# EAGLE design ManualBoardV1 (EAGLE 9.6.2)
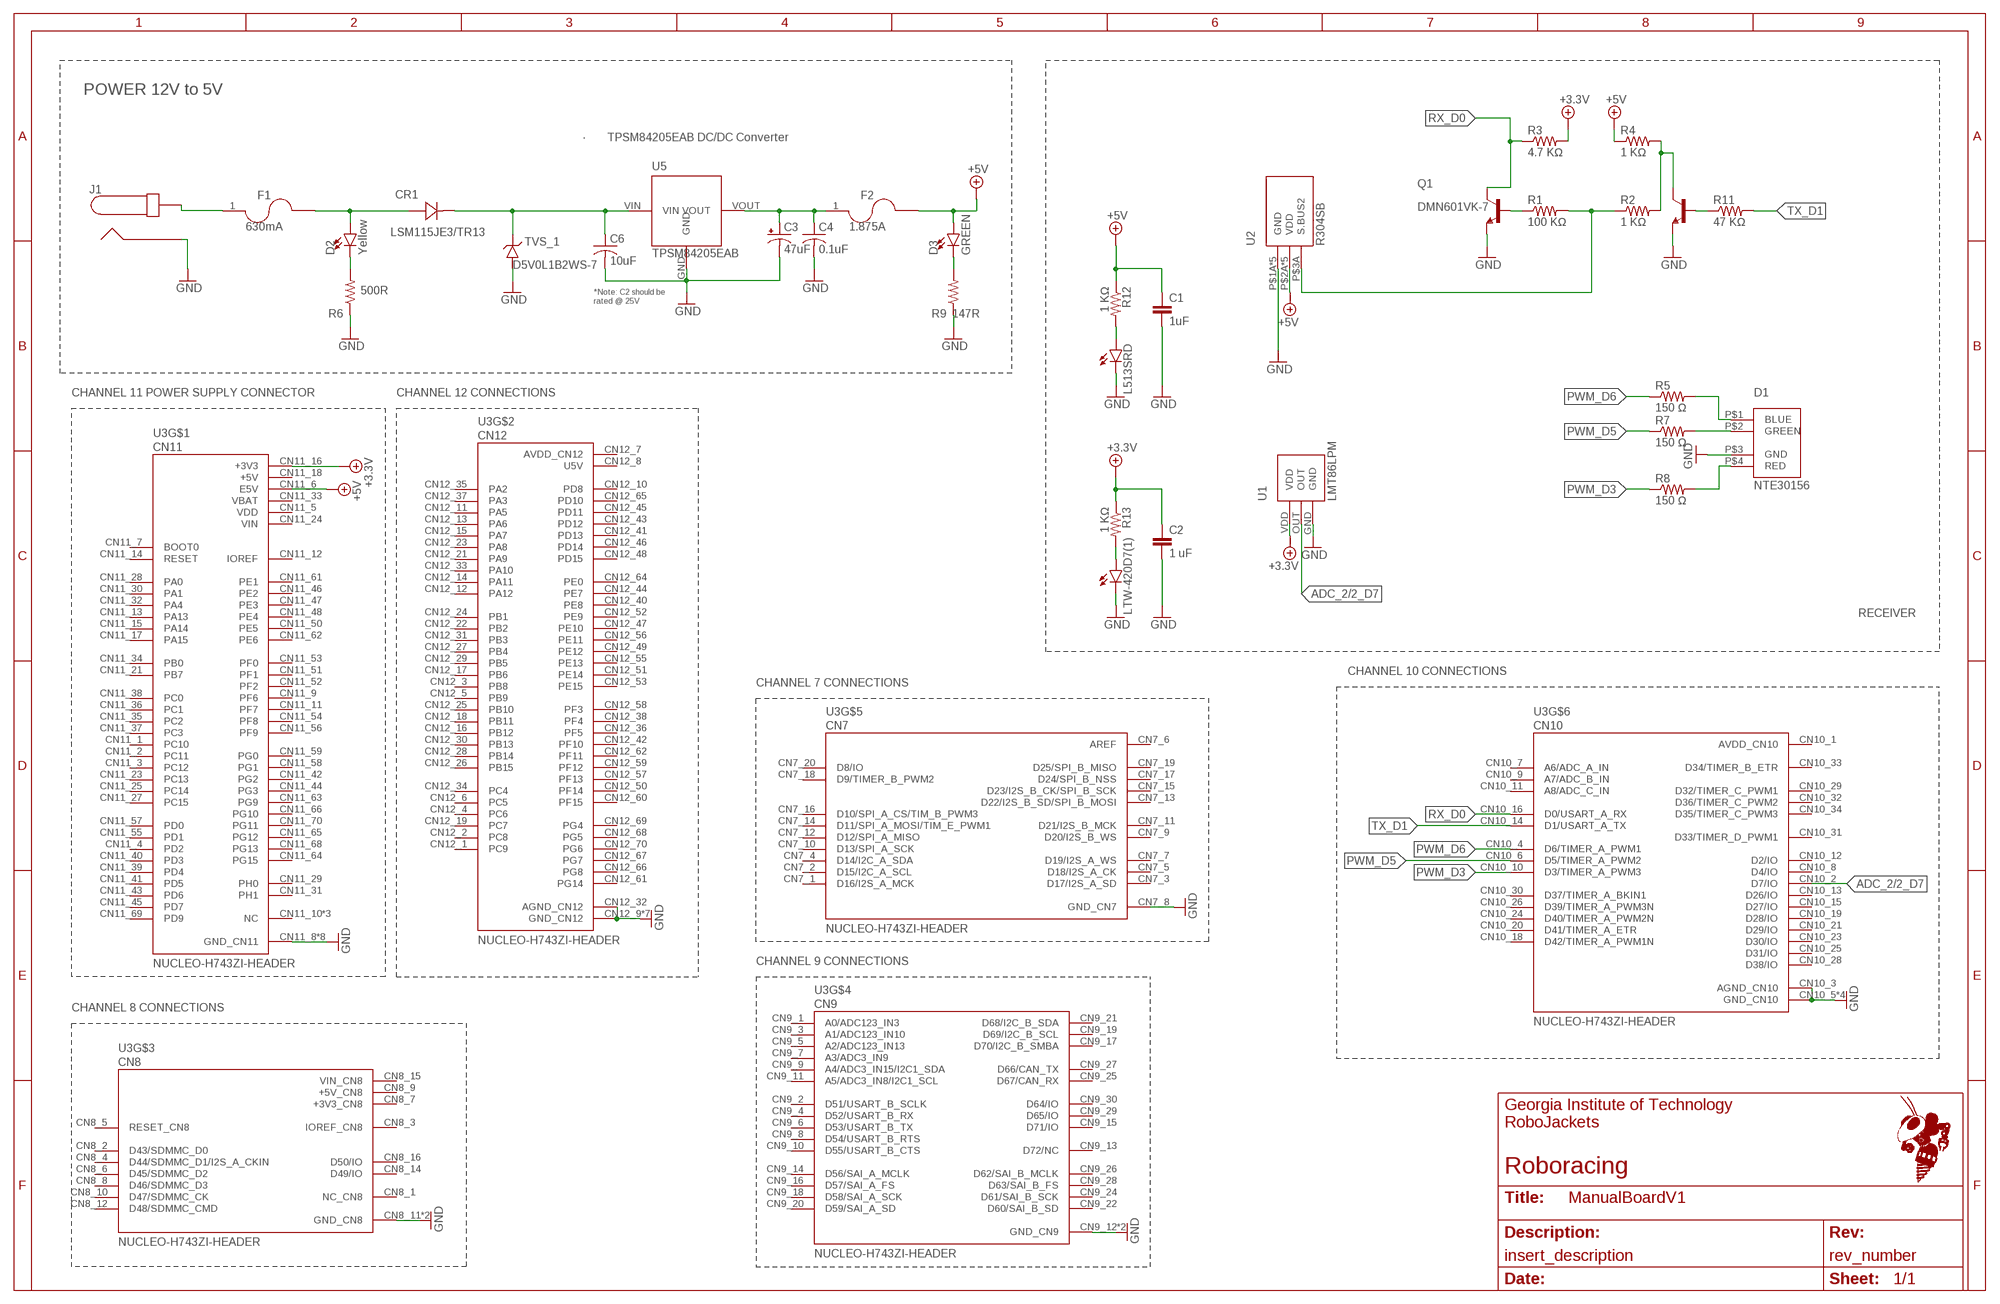
[diagram p0: schematic, sheet 1]
FRAME1 (FRAME_11_17): REVISION: rev_number; SCH_DESC: insert_description; TEAM: Roboracing

## Parts
C1  1uF  C2,5-3  [C2.5-3]
C2  1 uF  C2,5-3  [C2.5-3]
C3  47uF  47UF-POLAR-EIA3528-10V-10%  [EIA3528]
C4  0.1uF  C-USC0805  [C0805]
C6  10uF  C-USC0805  [C0805]
CR1  LSM115JE3/TR13  [DO-214BA_MCH]
D1  NTE30156  [4-PIN]
D2  Yellow  LED-YELLOW0603  [LED-0603]
D3  GREEN  LED-GREEN1206  [LED-1206]
F1  630mA  SMD_FUSE0603  [F0603]
F2  1.875A  SMD_FUSE0603  [F0603]
J1  PJ-037A  [PJ-037A]
L513SRD  LED5MM  [LED5MM]
LTW-420D7(1)  LED5MM  [LED5MM]
Q1  DMN601VK-7  [SOT563]
R1  100 KΩ  R-US_0204/7  [0204/7]
R2  1 KΩ  R-US_0204/7  [0204/7]
R3  4.7 KΩ  R-US_0204/7  [0204/7]
R4  1 KΩ  R-US_0204/7  [0204/7]
R5  150 Ω  R-US_0204/7  [0204/7]
R6  500R  R-US_R0603  [R0603]
R7  150 Ω  R-US_0204/7  [0204/7]
R8  150 Ω  R-US_0204/7  [0204/7]
R9  147R  R-US_R0603  [R0603]
R11  47 KΩ  R-US_0204/7  [0204/7]
R12  1 KΩ  R-US_0204/7  [0204/7]
R13  1 KΩ  R-US_0204/7  [0204/7]
TVS_1  D5V0L1B2WS-7  [SOD-323]
U1  LMT86LPM  [LP]
U2  R304SB  [R304SB]
U3  NUCLEO-H743ZI-HEADER  [MODULE_NUCLEO-HEADER]
U5  TPSM84205EAB  [TPSM84205EAB]

## Nets
5V_MAIN: C3.A(+) C4.1 F2.1 U5.VOUT
+3.3V: C2.1 R3.2 R13.1 U1.VDD U3.CN11_16(+3V3)
+5V: C1.1 D3.A F2.2 R4.1 R12.1 U2.P$2A(VDD) U2.P$2B(VDD) U2.P$2C(VDD) U2.P$2D(VDD) U2.P$2E(VDD) U3.CN11_6(E5V)
ADC_2/2_D7: U1.OUT U3.CN10_2(D7/IO)
GND: C1.2 C2.2 C3.C(-) C4.2 C6.2 D1.P$3(GND) J1.P$1 L513SRD.K(C) LTW-420D7(1).K(C) Q1.D1(E) Q1.D2(E1) R6.1 R9.1 TVS_1.A U1.GND U2.P$1A(GND) U2.P$1B(GND) U2.P$1C(GND) U2.P$1D(GND) U2.P$1E(GND) U3.CN7_8(GND_CN7) U3.CN8_11(GND_CN8) U3.CN8_13(GND_CN8) U3.CN9_12(GND_CN9) U3.CN9_23(GND_CN9) U3.CN10_5(GND_CN10) U3.CN10_17(GND_CN10) U3.CN10_22(GND_CN10) U3.CN10_27(GND_CN10) U3.CN11_8(GND_CN11) U3.CN11_19(GND_CN11) U3.CN11_20(GND_CN11) U3.CN11_22(GND_CN11) U3.CN11_49(GND_CN11) U3.CN11_60(GND_CN11) U3.CN11_71(GND_CN11) U3.CN11_72(GND_CN11) U3.CN12_9(GND_CN12) U3.CN12_20(GND_CN12) U3.CN12_32(AGND_CN12) U3.CN12_39(GND_CN12) U3.CN12_54(GND_CN12) U3.CN12_63(GND_CN12) U3.CN12_71(GND_CN12) U3.CN12_72(GND_CN12) U5.GND
N$1: Q1.G1(B) R1.1
N$2: Q1.S2(C1) R2.2 R4.2
N$3: C6.1 CR1.1 TVS_1.C U5.VIN
N$4: F1.1 J1.P$2
N$5: D1.P$1(BLUE) R5.2
N$6: R1.2 R2.1 U2.P$3A(S.BUS2)
N$7: D1.P$2(GREEN) R7.2
N$8: CR1.2 D2.A F1.2
N$9: D1.P$4(RED) R8.2
N$10: D2.C R6.2
N$11: D3.C R9.2
N$12: U3.CN10_3(AGND_CN10)
N$13: Q1.G2(B1) R11.1
N$16: L513SRD.A R12.2
N$17: LTW-420D7(1).A R13.2
PWM_D3: R8.1 U3.CN10_10(D3/TIMER_A_PWM3)
PWM_D5: R7.1 U3.CN10_6(D5/TIMER_A_PWM2)
PWM_D6: R5.1 U3.CN10_4(D6/TIMER_A_PWM1)
RX_D0: Q1.S1(C) R3.1 U3.CN10_16(D0/USART_A_RX)
TX_D1: R11.2 U3.CN10_14(D1/USART_A_TX)
Unconnected: U3.CN7_1(D16/I2S_A_MCK) U3.CN7_2(D15/I2C_A_SCL) U3.CN7_3(D17/I2S_A_SD) U3.CN7_4(D14/I2C_A_SDA) U3.CN7_5(D18/I2S_A_CK) U3.CN7_7(D19/I2S_A_WS) U3.CN7_9(D20/I2S_B_WS) U3.CN7_10(D13/SPI_A_SCK) U3.CN7_11(D21/I2S_B_MCK) U3.CN7_12(D12/SPI_A_MISO) U3.CN7_13(D22/I2S_B_SD/SPI_B_MOSI) U3.CN7_14(D11/SPI_A_MOSI/TIM_E_PWM1) U3.CN7_15(D23/I2S_B_CK/SPI_B_SCK) U3.CN7_16(D10/SPI_A_CS/TIM_B_PWM3) U3.CN7_17(D24/SPI_B_NSS) U3.CN7_18(D9/TIMER_B_PWM2) U3.CN7_19(D25/SPI_B_MISO) U3.CN7_20(D8/IO) U3.CN8_1(NC_CN8) U3.CN8_2(D43/SDMMC_D0) U3.CN8_3(IOREF_CN8) U3.CN8_4(D44/SDMMC_D1/I2S_A_CKIN) U3.CN8_5(RESET_CN8) U3.CN8_6(D45/SDMMC_D2) U3.CN8_8(D46/SDMMC_D3) U3.CN8_10(D47/SDMMC_CK) U3.CN8_12(D48/SDMMC_CMD) U3.CN8_14(D49/IO) U3.CN8_16(D50/IO) U3.CN9_1(A0/ADC123_IN3) U3.CN9_2(D51/USART_B_SCLK) U3.CN9_3(A1/ADC123_IN10) U3.CN9_4(D52/USART_B_RX) U3.CN9_5(A2/ADC123_IN13) U3.CN9_6(D53/USART_B_TX) U3.CN9_7(A3/ADC3_IN9) U3.CN9_8(D54/USART_B_RTS) U3.CN9_9(A4/ADC3_IN15/I2C1_SDA) U3.CN9_10(D55/USART_B_CTS) U3.CN9_11(A5/ADC3_IN8/I2C1_SCL) U3.CN9_13(D72/NC) U3.CN9_14(D56/SAI_A_MCLK) U3.CN9_15(D71/IO) U3.CN9_16(D57/SAI_A_FS) U3.CN9_17(D70/I2C_B_SMBA) U3.CN9_18(D58/SAI_A_SCK) U3.CN9_19(D69/I2C_B_SCL) U3.CN9_20(D59/SAI_A_SD) U3.CN9_21(D68/I2C_B_SDA) U3.CN9_22(D60/SAI_B_SD) U3.CN9_24(D61/SAI_B_SCK) U3.CN9_25(D67/CAN_RX) U3.CN9_26(D62/SAI_B_MCLK) U3.CN9_27(D66/CAN_TX) U3.CN9_28(D63/SAI_B_FS) U3.CN9_29(D65/IO) U3.CN9_30(D64/IO) U3.CN10_7(A6/ADC_A_IN) U3.CN10_8(D4/IO) U3.CN10_9(A7/ADC_B_IN) U3.CN10_11(A8/ADC_C_IN) U3.CN10_12(D2/IO) U3.CN10_13(D26/IO) U3.CN10_15(D27/IO) U3.CN10_18(D42/TIMER_A_PWM1N) U3.CN10_19(D28/IO) U3.CN10_20(D41/TIMER_A_ETR) U3.CN10_21(D29/IO) U3.CN10_23(D30/IO) U3.CN10_24(D40/TIMER_A_PWM2N) U3.CN10_25(D31/IO) U3.CN10_26(D39/TIMER_A_PWM3N) U3.CN10_28(D38/IO) U3.CN10_29(D32/TIMER_C_PWM1) U3.CN10_30(D37/TIMER_A_BKIN1) U3.CN10_31(D33/TIMER_D_PWM1) U3.CN10_32(D36/TIMER_C_PWM2) U3.CN10_33(D34/TIMER_B_ETR) U3.CN10_34(D35/TIMER_C_PWM3) U3.CN11_1(PC10) U3.CN11_2(PC11) U3.CN11_3(PC12) U3.CN11_4(PD2) U3.CN11_7(BOOT0) U3.CN11_9(PF6) U3.CN11_10(NC) U3.CN11_11(PF7) U3.CN11_12(IOREF) U3.CN11_13(PA13) U3.CN11_14(RESET) U3.CN11_15(PA14) U3.CN11_17(PA15) U3.CN11_21(PB7) U3.CN11_23(PC13) U3.CN11_25(PC14) U3.CN11_26(NC) U3.CN11_27(PC15) U3.CN11_28(PA0) U3.CN11_29(PH0) U3.CN11_30(PA1) U3.CN11_31(PH1) U3.CN11_32(PA4) U3.CN11_34(PB0) U3.CN11_35(PC2) U3.CN11_36(PC1) U3.CN11_37(PC3) U3.CN11_38(PC0) U3.CN11_39(PD4) U3.CN11_40(PD3) U3.CN11_41(PD5) U3.CN11_42(PG2) U3.CN11_43(PD6) U3.CN11_44(PG3) U3.CN11_45(PD7) U3.CN11_46(PE2) U3.CN11_47(PE3) U3.CN11_48(PE4) U3.CN11_50(PE5) U3.CN11_51(PF1) U3.CN11_52(PF2) U3.CN11_53(PF0) U3.CN11_54(PF8) U3.CN11_55(PD1) U3.CN11_56(PF9) U3.CN11_57(PD0) U3.CN11_58(PG1) U3.CN11_59(PG0) U3.CN11_61(PE1) U3.CN11_62(PE6) U3.CN11_63(PG9) U3.CN11_64(PG15) U3.CN11_65(PG12) U3.CN11_66(PG10) U3.CN11_67(NC) U3.CN11_68(PG13) U3.CN11_69(PD9) U3.CN11_70(PG11) U3.CN12_1(PC9) U3.CN12_2(PC8) U3.CN12_3(PB8) U3.CN12_4(PC6) U3.CN12_5(PB9) U3.CN12_6(PC5) U3.CN12_10(PD8) U3.CN12_11(PA5) U3.CN12_12(PA12) U3.CN12_13(PA6) U3.CN12_14(PA11) U3.CN12_15(PA7) U3.CN12_16(PB12) U3.CN12_17(PB6) U3.CN12_18(PB11) U3.CN12_19(PC7) U3.CN12_21(PA9) U3.CN12_22(PB2) U3.CN12_23(PA8) U3.CN12_24(PB1) U3.CN12_25(PB10) U3.CN12_26(PB15) U3.CN12_27(PB4) U3.CN12_28(PB14) U3.CN12_29(PB5) U3.CN12_30(PB13) U3.CN12_31(PB3) U3.CN12_33(PA10) U3.CN12_34(PC4) U3.CN12_35(PA2) U3.CN12_36(PF5) U3.CN12_37(PA3) U3.CN12_38(PF4) U3.CN12_40(PE8) U3.CN12_41(PD13) U3.CN12_42(PF10) U3.CN12_43(PD12) U3.CN12_44(PE7) U3.CN12_45(PD11) U3.CN12_46(PD14) U3.CN12_47(PE10) U3.CN12_48(PD15) U3.CN12_49(PE12) U3.CN12_50(PF14) U3.CN12_51(PE14) U3.CN12_52(PE9) U3.CN12_53(PE15) U3.CN12_55(PE13) U3.CN12_56(PE11) U3.CN12_57(PF13) U3.CN12_58(PF3) U3.CN12_59(PF12) U3.CN12_60(PF15) U3.CN12_61(PG14) U3.CN12_62(PF11) U3.CN12_64(PE0) U3.CN12_65(PD10) U3.CN12_66(PG8) U3.CN12_67(PG7) U3.CN12_68(PG5) U3.CN12_69(PG4) U3.CN12_70(PG6)

## Notes on the sheet
- POWER 12V to 5V
- ·       TPSM84205EAB DC/DC Converter
- *Note: C2 should be
  rated @ 25V
- CHANNEL 11 POWER SUPPLY CONNECTOR | CHANNEL 12 CONNECTIONS
- RECEIVER
- CHANNEL 10 CONNECTIONS
- CHANNEL 7 CONNECTIONS
- CHANNEL 9 CONNECTIONS
- CHANNEL 8 CONNECTIONS

## Power pins joined to a net without a drawn wire
+3V3_CN8: U3.CN8_7(+3V3_CN8)
+5V: U3.CN11_18(+5V)
+5V_CN8: U3.CN8_9(+5V_CN8)
AREF: U3.CN7_6(AREF)
AVDD_CN10: U3.CN10_1(AVDD_CN10)
AVDD_CN12: U3.CN12_7(AVDD_CN12)
U5V: U3.CN12_8(U5V)
VBAT: U3.CN11_33(VBAT)
VDD: U3.CN11_5(VDD)
VIN: U3.CN11_24(VIN)
VIN_CN8: U3.CN8_15(VIN_CN8)

## Library data of the parts
C1 C2 = capacitor-wima:C: CAPACITOR naming: grid - package width
C3 = SparkFun-Capacitors:47UF-POLAR: 47µF polarized capacitors A capacitor is a passive two-terminal electrical component used to store electrical energy temporarily in an electric field.; PROD_ID: CAP-08310
C4 C6 = rcl:C-US: CAPACITOR, American symbol; SPICEPREFIX: C
CR1 = RoboRacing_STM:LSM115JE3/TR13; COPYRIGHT: Copyright (C) 2022 Ultra Librarian. All rights reserved.; MANUFACTURER_PART_NUMBER: LSM115JE3/TR13; MFR_NAME: Microchip
D1 = RoboRacing Manual Board:NTE30156: Red, Green, Blue (RGB) - LED Indication - Discrete 2V Red, 3.2V Green, 3.2V Blue Radial https://www.nteinc.com/specs/30100to30199/pdf/nte30153_56.pdf; DKPN: 2368-NTE30156-ND
D2 = RoboJackets-LEDs:LED-YELLOW: Yellow SMD LED Used in manufacturing several products at SparkFun. Packages: 0603 - SMD 0603 package[Product Link] <http://www.kingbrightusa.com/product.asp?catalog_name=LED&product_id=APT1608SYCK> 0603 -SMART - SMART SMD 0603 package (more efficient/more expensive) [Product Link] <http://www.osram-os.com/osram_os/en/products/product-catalog/led-light-emitting-diodes/smartled-0603/ly-l29k/index.jsp> LilyPad - SMD1206 package[Product Datasheet] <https://www.sparkfun.com/datasheets/DevTools/LilyPad/Q150YUS4.pdf> SparkFun Products: Blynk Board <https://www.sparkfun.com/products/13794> IOIO-OTG <https://www.sparkfun.com/products/13613> XBee Explorer Serial <https://www.sparkfun.com/products/13225>; PROD_ID: DIO-09003
D3 = RoboJackets-LEDs:LED-GREEN: Green SMD LED Used in manufacturing of various products at SparkFun Packages: 0603 - SMD 0603 package [Product Link] <http://www.futureelectronics.com/en/technologies/semiconductors/optoelectronics/leds/Pages/9894312-LTST-C190GKT.aspx?CrossPart=HSMG-C190&IM=0> LilyPad 1206 - SMD1206 LilyPad package [Product Link] <http://www.futureelectronics.com/en/Technologies/Product.aspx?ProductID=IN150NGHARVATEKCORPORATION2049943&IM=0> 1206 - SMD1206 package [Product Link] <http://www.futureelectronics.com/en/technologies/semiconductors/optoelectronics/leds/Pages/8315665-LTST-C150KGKT.aspx?IM=0> 1206 Bottom Mount -SMD 1206 Bottom Mount [Product Link] <http://www.digikey.com/product-detail/en/lite-on-inc/LTST-C230KGKT/160-1456-1-ND/386854> SparkFun Products: Pro Mini 328 -5V <https://www.sparkfun.com/products/821> RedBoard <https://www.sparkfun.com/products/12757> MP3 Trigger <https://www.sparkfun.com/products/13720> Makey Makey <https://www.sparkfun.com/products/11076>; PROD_ID: DIO-00862
F1 F2 = RoboJackets-Fuses:SMD_FUSE: Generic part for SMD fuses
J1 = RoboJackets-Connectors:PJ-037A*: Description: Power Barrel Connector Jack 2.10mm ID (0.083"), 5.50mm OD (0.217") Through Hole, Right Angle Link 2.5A: Digi-Key <https://www.digikey.com/products/en?keywords=CP-037A-ND> Link 5A: Digi-Key <https://www.digikey.com/product-detail/en/cui-devices/PJ-037AH/CP-037AH-ND/1644547>; DKPN: CP-037A-ND
L513SRD LTW-420D7(1) = led:LED: LED OSRAM: - CHIPLED LG R971, LG N971, LY N971, LG Q971, LY Q971, LO R971, LY R971 LH N974, LH R974 LS Q976, LO Q976, LY Q976 LO Q996 - Hyper CHIPLED LW Q18S LB Q993, LB Q99A, LB R99A - SideLED LS A670, LO A670, LY A670, LG A670, LP A670 LB A673, LV A673, LT A673, LW A673 LH A674 LY A675 LS A676, LA A676, LO A676, LY A676, LW A676 LS A679, LY A679, LG A679 - Hyper Micro SIDELED® LS Y876, LA Y876, LO Y876, LY Y876 LT Y87S - SmartLED LW L88C, LW L88S LB L89C, LB L89S, LG L890 LS L89K, LO L89K, LY L89K LS L896, LA L896, LO L896, LY L896 - TOPLED LS T670, LO T670, LY T670, LG T670, LP T670 LSG T670, LSP T670, LSY T670, LOP T670, LYG T670 LG T671, LOG T671, LSG T671 LB T673, LV T673, LT T673, LW T673 LH T674 LS T676, LA T676, LO T676, LY T676, LB T676, LH T676, LSB T676, LW T676 LB T67C, LV T67C, LT T67C, LS T67K, LO T67K, LY T67K, LW E67C LS E67B, LA E67B, LO E67B, LY E67B, LB E67C, LV E67C, LT E67C LW T67C LS T679, LY T679, LG T679 LS T770, LO T770, LY T770, LG T770, LP T770 LB T773, LV T773, LT T773, LW T773 LH T774 LS E675, LA E675, LY E675, LS T675 LS T776, LA T776, LO T776, LY T776, LB T776 LHGB T686 LT T68C, LB T68C - Hyper Mini TOPLED® LB M676 - Mini TOPLED Santana® LG M470 LS M47K, LO M47K, LY M47K Source: http://www.osram.convergy.de LUXEON: - LUMILED® LXK2-PW12-R00, LXK2-PW12-S00, LXK2-PW14-U00, LXK2-PW14-V00 LXK2-PM12-R00, LXK2-PM12-S00, LXK2-PM14-U00 LXK2-PE12-Q00, LXK2-PE12-R00, LXK2-PE12-S00, LXK2-PE14-T00, LXK2-PE14-U00 LXK2-PB12-K00, LXK2-PB12-L00, LXK2-PB12-M00, LXK2-PB14-N00, LXK2-PB14-P00, LXK2-PB14-Q00 LXK2-PR12-L00, LXK2-PR12-M00, LXK2-PR14-Q00, LXK2-PR14-R00 LXK2-PD12-Q00, LXK2-PD12-R00, LXK2-PD12-S00 LXK2-PH12-R00, LXK2-PH12-S00 LXK2-PL12-P00, LXK2-PL12-Q00, LXK2-PL12-R00 Source: www.luxeon.com KINGBRIGHT: KA-3528ASYC Source: www.kingbright.com
Q1 = RoboRacing Manual Board:DMN601VK-7: Mosfet Array 2 N-Channel (Dual) 60V 305mA 250mW Surface Mount SOT-563 https://www.diodes.com/assets/Datasheets/ds30655.pdf; DKPN: DMN601VKDITR-ND
R1-R9 R11-R13 = rcl:R-US_: RESISTOR, American symbol; SPICEPREFIX: R
TVS_1 = RoboJackets-Diodes:D5V0L1B2WS-7: TVS 5V Diode Datasheet <https://www.diodes.com/assets/Datasheets/D5V0L1B2WS.pdf>; DKPN: D5V0L1B2WS-7DICT-ND
U1 = RoboRacing Manual Board:LMT86LPM: https://www.ti.com/lit/ds/symlink/lmt86.pdf?HQS=dis-dk-null-digikeymode-dsf-pf-null-wwe&ts=1642975424297 Temperature Sensor Analog, Local -50°C ~ 150°C 10.9mV/°C TO-92-3; DKPN: 296-46127-1-ND
U2 = RoboRacing Manual Board:R304SB: R304SB– T-FHSS Telemetry System 4-Channel Receiver https://futabausa.com/product/r304sb/; DKPN: N/A
U3 = RoboRacing_STM:NUCLEO-H743ZI-HEADER: STM32F429ZI, mbed-Enabled Development Nucleo-144 STM32F4 ARM® Cortex®-M4 MCU 32-Bit Embedded Evaluation Board; MANUFACTURER: STMicroelectronics; MAXIMUM_PACKAGE_HEIGHT: N/A; PARTREV: 8; STANDARD: Manufacturer Recommendations
U5 = RoboRacing_STM:TPSM84205EAB: 1.5A, 28V Input, 5V Output Power Module https://www.ti.com/lit/ds/symlink/tpsm84205.pdf?ts=1642464100890&ref_url=https%253A%252F%252Fwww.ti.com%252Fstore%252Fti%252Fen%252Fp%252Fproduct%252F%253Fp%253DTPSM84205EAB; DKPN: 296-47074-ND

## Net classes
1 vcc: width 0.3 mm

## Board
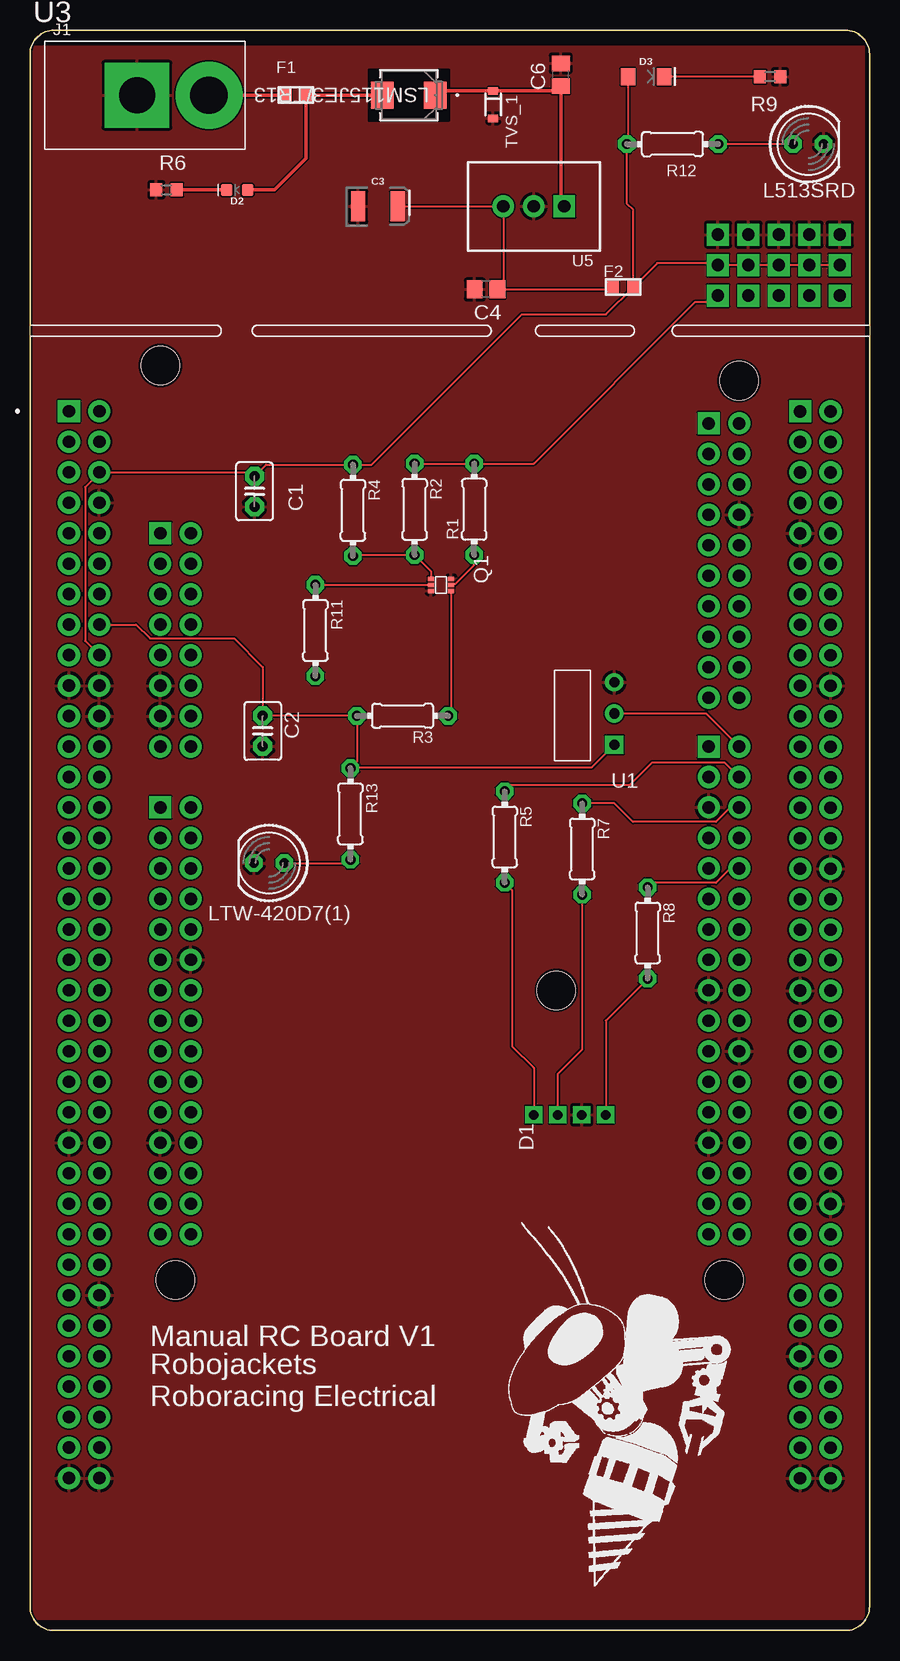
[diagram p1: board, top side]
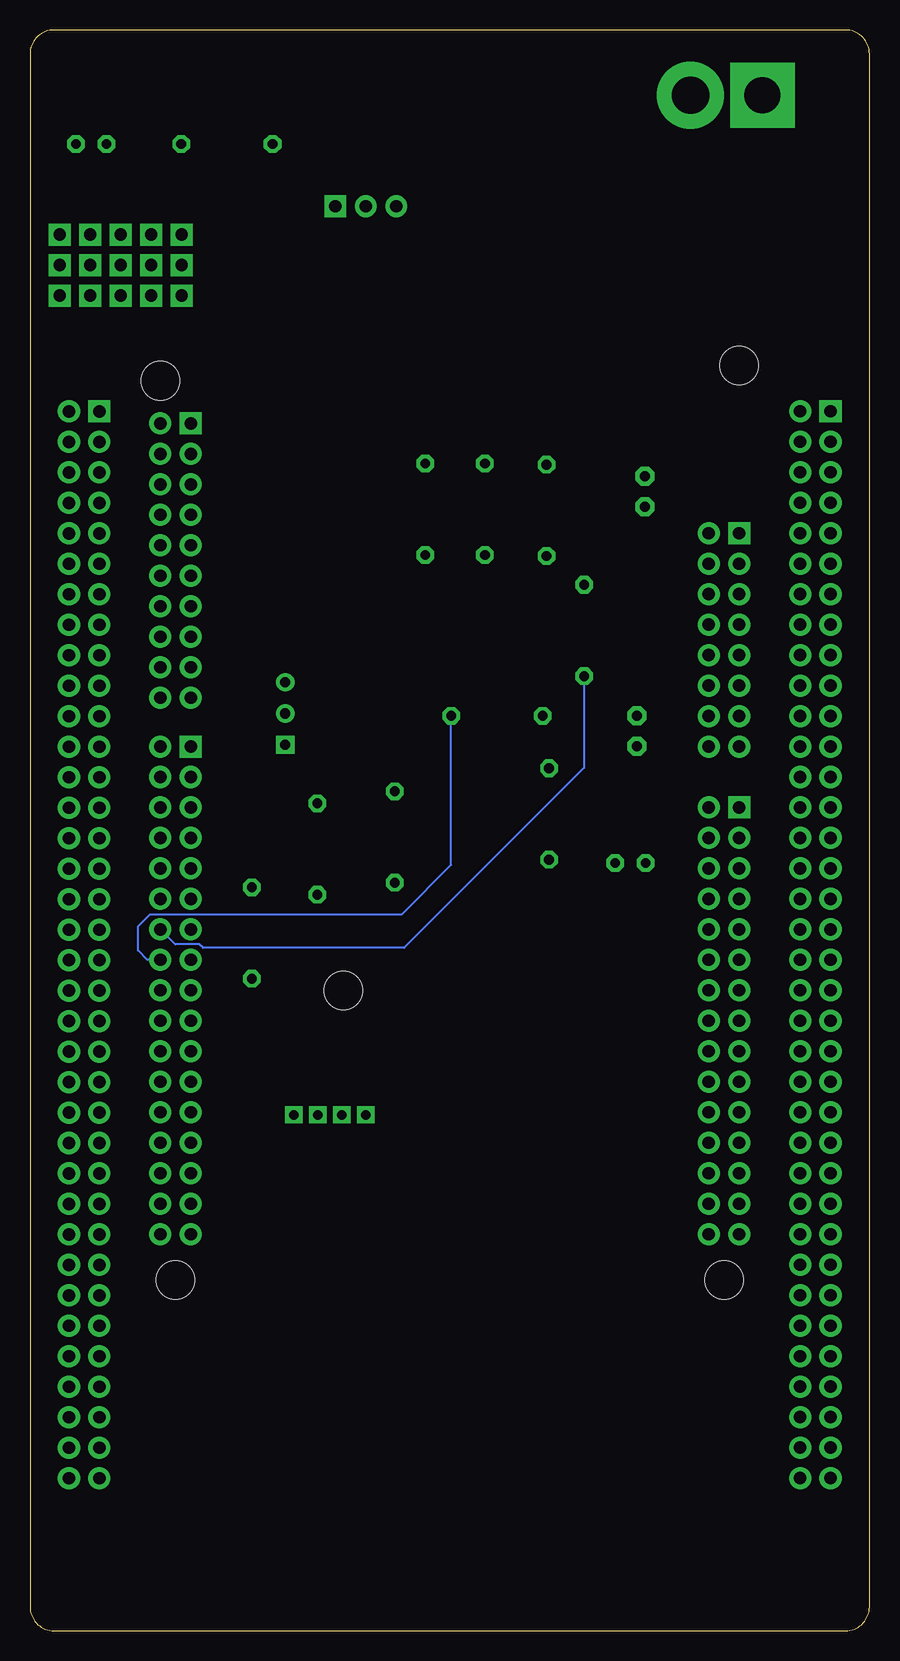
[diagram p2: board, bottom side, seen from below]

Size 70 x 133.4 mm. Coordinates in mm from the lower left corner, seen from the top.
Outline: 0,2 0,131.4 arc-90 2,133.4 68,133.4 arc-90 70,131.4 70,2 arc-90 68,0 2,0 arc-90 0,2
Copper layers (1*16): Top 0.035mm / dielectric 1.6mm / Bottom 0.035mm
Design rules "jlcpcb-2layers": minimum track width 5mil, minimum drill 0.3mm, track to track 5mil, track to pad 5mil, pad to pad 5mil, via to via 5mil, smd to smd 5mil, copper to edge 0.2mm, drill to drill 6mil, minimum pad ring 10mil, minimum via ring 3mil, stop-mask expansion 4mil, vias tented up to drill 0mil, thermal gap 10mil

### Footprints (pad centres in the part's own frame; a part is rotated, then mirrored left to right if it is on the bottom)
C2.5-3 = drill 0.813 pad 1.6 octagon: 1 -1.27,0; 2 1.27,0
EIA3528 = smd 1.2 x 2.5: A 1.65,0; C -1.65,0
C0805 = smd 1.3 x 1.5: 1 -0.95,0; 2 0.95,0
DO-214BA_MCH = smd 1.874 x 2.26: 1 -2.207,0; 2 2.207,0
4-PIN = drill 0.8 pad 1.016 square: P$1 0,6; P$2 0,4; P$3 0,2; P$4 0,0
LED-0603 = smd 1 x 1: A -0.877,0; C 0.877,0
LED-1206 = smd 1.2 x 1.4: A -1.5,0; C 1.5,0
F0603 = smd 1 x 1.1: 1 -0.85,0; 2 0.85,0
PJ-037A = drill 3 square: P$1 0,0 | drill 3.1: P$2 6,0
LED5MM = drill 0.813 octagon: A -1.27,0; K 1.27,0
SOT563 = smd 0.375 x 0.5: D1 1,0; D2 0,1.7; G1 0.5,1.7; G2 0.5,0; S1 1,1.7; S2 0,0
0204/7 = drill 0.813 octagon: 1 -3.81,0; 2 3.81,0
R0603 = smd 1 x 1.1: 1 -0.85,0; 2 0.85,0
SOD-323 = smd 0.63 x 0.83: A 1.15,0; C -1.15,0
LP = drill 0.85: GND 0,0; OUT 0,2.6 | drill 0.85 square: VDD 0,5.2
R304SB = drill 1.02 pad 1.27 square: P$1A 0,5.08; P$1B 2.54,5.08; P$1C 5.08,5.08; P$1D 7.62,5.08; P$1E 10.16,5.08; P$2A 0,2.54; P$2B 2.54,2.54; P$2C 5.08,2.54; P$2D 7.62,2.54; P$2E 10.16,2.54; P$3A 0,0; P$3B 2.54,0; P$3C 5.08,0; P$3D 7.62,0; P$3E 10.16,0
MODULE_NUCLEO-HEADER = drill 1.02 square: CN7_1 21.59,33.914; CN8_1 -24.13,24.77; CN9_1 -24.13,1.91; CN10_1 21.59,6.99; CN11_1 -31.75,34.93; CN12_1 29.21,34.91 | drill 1.02: CN7_2 24.13,33.914; CN7_3 21.59,31.374; CN7_4 24.13,31.374; CN7_5 21.59,28.834; CN7_6 24.13,28.834; CN7_7 21.59,26.294; CN7_8 24.13,26.294; CN7_9 21.59,23.754; CN7_10 24.13,23.754; CN7_11 21.59,21.214; CN7_12 24.13,21.214; CN7_13 21.59,18.674; CN7_14 24.13,18.674; CN7_15 21.59,16.134; CN7_16 24.13,16.134; CN7_17 21.59,13.594; CN7_18 24.13,13.594; CN7_19 21.59,11.054; CN7_20 24.13,11.054; CN8_2 -21.59,24.77; CN8_3 -24.13,22.23; CN8_4 -21.59,22.23; CN8_5 -24.13,19.69; CN8_6 -21.59,19.69; CN8_7 -24.13,17.15; CN8_8 -21.59,17.15; CN8_9 -24.13,14.61; CN8_10 -21.59,14.61; CN8_11 -24.13,12.07; CN8_12 -21.59,12.07; CN8_13 -24.13,9.53; CN8_14 -21.59,9.53; CN8_15 -24.13,6.99; CN8_16 -21.59,6.99; CN9_2 -21.59,1.91; CN9_3 -24.13,-0.63; CN9_4 -21.59,-0.63; CN9_5 -24.13,-3.17; CN9_6 -21.59,-3.17; CN9_7 -24.13,-5.71; CN9_8 -21.59,-5.71; CN9_9 -24.13,-8.25; CN9_10 -21.59,-8.25; CN9_11 -24.13,-10.79; CN9_12 -21.59,-10.79; CN9_13 -24.13,-13.33; CN9_14 -21.59,-13.33; CN9_15 -24.13,-15.87; CN9_16 -21.59,-15.87; CN9_17 -24.13,-18.41; CN9_18 -21.59,-18.41; CN9_19 -24.13,-20.95; CN9_20 -21.59,-20.95; CN9_21 -24.13,-23.49; CN9_22 -21.59,-23.49; CN9_23 -24.13,-26.03; CN9_24 -21.59,-26.03; CN9_25 -24.13,-28.57; CN9_26 -21.59,-28.57; CN9_27 -24.13,-31.11; CN9_28 -21.59,-31.11; CN9_29 -24.13,-33.65; CN9_30 -21.59,-33.65; CN10_2 24.13,6.99; CN10_3 21.59,4.45; CN10_4 24.13,4.45; CN10_5 21.59,1.91; CN10_6 24.13,1.91; CN10_7 21.59,-0.63; CN10_8 24.13,-0.63; CN10_9 21.59,-3.17; CN10_10 24.13,-3.17; CN10_11 21.59,-5.71; CN10_12 24.13,-5.71; CN10_13 21.59,-8.25; CN10_14 24.13,-8.25; CN10_15 21.59,-10.79; CN10_16 24.13,-10.79; CN10_17 21.59,-13.33; CN10_18 24.13,-13.33; CN10_19 21.59,-15.87; CN10_20 24.13,-15.87; CN10_21 21.59,-18.41; CN10_22 24.13,-18.41; CN10_23 21.59,-20.95; CN10_24 24.13,-20.95; CN10_25 21.59,-23.49; CN10_26 24.13,-23.49; CN10_27 21.59,-26.03; CN10_28 24.13,-26.03; CN10_29 21.59,-28.57; CN10_30 24.13,-28.57; CN10_31 21.59,-31.11; CN10_32 24.13,-31.11; CN10_33 21.59,-33.65; CN10_34 24.13,-33.65; CN11_2 -29.21,34.93; CN11_3 -31.75,32.39; CN11_4 -29.21,32.39; CN11_5 -31.75,29.85; CN11_6 -29.21,29.85; CN11_7 -31.75,27.31; CN11_8 -29.21,27.31; CN11_9 -31.75,24.77; CN11_10 -29.21,24.77; CN11_11 -31.75,22.23; CN11_12 -29.21,22.23; CN11_13 -31.75,19.69; CN11_14 -29.21,19.69; CN11_15 -31.75,17.15; CN11_16 -29.21,17.15; CN11_17 -31.75,14.61; CN11_18 -29.21,14.61; CN11_19 -31.75,12.07; CN11_20 -29.21,12.07; CN11_21 -31.75,9.53; CN11_22 -29.21,9.53; CN11_23 -31.75,6.99; CN11_24 -29.21,6.99; CN11_25 -31.75,4.45; CN11_26 -29.21,4.45; CN11_27 -31.75,1.91; CN11_28 -29.21,1.91; CN11_29 -31.75,-0.63; CN11_30 -29.21,-0.63; CN11_31 -31.75,-3.17; CN11_32 -29.21,-3.17; CN11_33 -31.75,-5.71; CN11_34 -29.21,-5.71; CN11_35 -31.75,-8.25; CN11_36 -29.21,-8.25; CN11_37 -31.75,-10.79; CN11_38 -29.21,-10.79; CN11_39 -31.75,-13.33; CN11_40 -29.21,-13.33; CN11_41 -31.75,-15.87; CN11_42 -29.21,-15.87; CN11_43 -31.75,-18.41; CN11_44 -29.21,-18.41; CN11_45 -31.75,-20.95; CN11_46 -29.21,-20.95; CN11_47 -31.75,-23.49; CN11_48 -29.21,-23.49; CN11_49 -31.75,-26.03; CN11_50 -29.21,-26.03; CN11_51 -31.75,-28.57; CN11_52 -29.21,-28.57; CN11_53 -31.75,-31.11; CN11_54 -29.21,-31.11; CN11_55 -31.75,-33.65; CN11_56 -29.21,-33.65; CN11_57 -31.75,-36.19; CN11_58 -29.21,-36.19; CN11_59 -31.75,-38.73; CN11_60 -29.21,-38.73; CN11_61 -31.75,-41.27; CN11_62 -29.21,-41.27; CN11_63 -31.75,-43.81; CN11_64 -29.21,-43.81; CN11_65 -31.75,-46.35; CN11_66 -29.21,-46.35; CN11_67 -31.75,-48.89; CN11_68 -29.21,-48.89; CN11_69 -31.75,-51.43; CN11_70 -29.21,-51.43; CN11_71 -31.75,-53.97; CN11_72 -29.21,-53.97; CN12_2 31.75,34.91; CN12_3 29.21,32.37; CN12_4 31.75,32.37; CN12_5 29.21,29.83; CN12_6 31.75,29.83; CN12_7 29.21,27.29; CN12_8 31.75,27.29; CN12_9 29.21,24.75; CN12_10 31.75,24.75; CN12_11 29.21,22.21; CN12_12 31.75,22.21; CN12_13 29.21,19.67; CN12_14 31.75,19.67; CN12_15 29.21,17.13; CN12_16 31.75,17.13; CN12_17 29.21,14.59; CN12_18 31.75,14.59; CN12_19 29.21,12.05; CN12_20 31.75,12.05; CN12_21 29.21,9.51; CN12_22 31.75,9.51; CN12_23 29.21,6.97; CN12_24 31.75,6.97; CN12_25 29.21,4.43; CN12_26 31.75,4.43; CN12_27 29.21,1.89; CN12_28 31.75,1.89; CN12_29 29.21,-0.65; CN12_30 31.75,-0.65; CN12_31 29.21,-3.19; CN12_32 31.75,-3.19; CN12_33 29.21,-5.73; CN12_34 31.75,-5.73; CN12_35 29.21,-8.27; CN12_36 31.75,-8.27; CN12_37 29.21,-10.81; CN12_38 31.75,-10.81; CN12_39 29.21,-13.35; CN12_40 31.75,-13.35; CN12_41 29.21,-15.89; CN12_42 31.75,-15.89; CN12_43 29.21,-18.43; CN12_44 31.75,-18.43; CN12_45 29.21,-20.97; CN12_46 31.75,-20.97; CN12_47 29.21,-23.51; CN12_48 31.75,-23.51; CN12_49 29.21,-26.05; CN12_50 31.75,-26.05; CN12_51 29.21,-28.59; CN12_52 31.75,-28.59; CN12_53 29.21,-31.13; CN12_54 31.75,-31.13; CN12_55 29.21,-33.67; CN12_56 31.75,-33.67; CN12_57 29.21,-36.21; CN12_58 31.75,-36.21; CN12_59 29.21,-38.75; CN12_60 31.75,-38.75; CN12_61 29.21,-41.29; CN12_62 31.75,-41.29; CN12_63 29.21,-43.83; CN12_64 31.75,-43.83; CN12_65 29.21,-46.37; CN12_66 31.75,-46.37; CN12_67 29.21,-48.91; CN12_68 31.75,-48.91; CN12_69 29.21,-51.45; CN12_70 31.75,-51.45; CN12_71 29.21,-53.99; CN12_72 31.75,-53.99 | hole 3.2: -22.86,-37.46; 22.86,-37.46; 24.13,37.47; 8.89,-13.33; -24.13,38.74
TPSM84205EAB = drill 1.01 pad 1.71: GND 0,0; VOUT 2.54,0 | drill 1.01 pad 1.71 square: VIN -2.54,0

### Placement (x,y rotation side)
C1  18.72,94.95 270 top
C2  19.4,74.98 270 top
C3  29,118.7 0 top
C4  38.03,111.79 180 top
C6  44.25,129.67 90 top
CR1  31.59,127.97 180 top
D1  48,43 90 top
D2  17.27,120.08 180 top
D3  51.36,129.51 0 top
F1  22.16,127.97 0 top
F2  49.45,111.97 0 top
J1  8.92,127.97 0 top
L513SRD  64.9,123.89 0 top
LTW-420D7(1)  19.94,63.98 180 top
Q1  33.42,87.65 270 top
R1  37.04,93.46 90 top
R2  32.07,93.46 270 top
R3  31.07,76.25 180 top
R4  26.93,93.37 270 top
R5  39.58,66.15 270 top
R6  11.38,120.08 0 top
R7  46.04,65.15 270 top
R8  51.5,58.15 270 top
R9  61.71,129.51 180 top
R11  23.8,83.36 270 top
R12  53.58,123.89 0 top
R13  26.72,68.07 270 top
TVS_1  38.62,127.18 270 top
U1  48.72,79.04 180 top
U2  57.36,111.27 0 top
U3  35,66.7 0 top
U5  42,118.7 180 top
U$1  [ROBOBUZZ_1.4X]  47,3.7 0 top

### Tracks (layer width: path | path; a pad name or v marks a point on that pad's centre or on a via)
5V_MAIN
  Top 0.152: F2.1 48.42,111.79 C4.1 39.46,112.27 U5.VOUT C3.A
+3.3V
  Top 0.152: U3.CN11_16 8.85,83.85 10,82.7 17,82.7 19.4,80.3 C2.1 R3.2 27.26,72.42 26.77,71.93 | 26.77,71.93 R13.1 | U1.VDD 46.81,71.93 26.77,71.93
+5V
  Top 0.152: D3.A 49.86,123.98 49.79,123.91 | 49.79,123.91 R12.1 | F2.2 50.3,118.4 49.79,118.91 49.79,123.91 | F2.2 48.03,109.7 41,109.7 28.48,97.18 R4.1 19.68,97.18 C1.1 18.39,96.55 U3.CN11_6 5.79,96.49 4.6,95.3 4.6,82.5 U3.CN11_18 | U2.P$2E U2.P$2D U2.P$2C U2.P$2B U2.P$2A 56.91,113.97 52.3,113.97 F2.2
ADC_2/2_D7
  Top 0.152: U3.CN10_2 56.38,76.44 U1.OUT
GND
  pour Top: 0.3,0.97 0.3,132.05 69.52,132.05 69.52,0.97
N$1
  Top 0.152: Q1.G1 35.2,87.23 35.47,87.23 37.04,88.81 R1.1
N$2
  Top 0.152: R4.2 27.02,89.65 R2.2 33.42,88.3 Q1.S2
N$3
  Top 0.152: CR1.1 34.16,128.33 | C6.1 43.86,128.33 | 44.25,118.99 U5.VIN
  Top 0.305: 34.16,128.33 TVS_1.C 43.86,128.33 | C6.1 44.25,118.99
N$4
  Top 0.305: F1.1 J1.P$2
N$5
  Top 0.152: D1.P$1 42,46.91 40.2,48.71 40.2,61.72 R5.2
N$6
  Top 0.152: R2.1 R1.2 42,97.27 55.43,110.7 56.79,110.7 U2.P$3A
N$7
  Top 0.152: R7.2 46.04,48.44 44,46.4 D1.P$2
N$8
  Top 0.305: D2.A 20.38,120.08 23.01,122.71 F1.2 CR1.2
N$9
  Top 0.152: R8.2 48,50.84 D1.P$4
N$10
  Top 0.305: R6.2 D2.C
N$11
  Top 0.152: R9.2 D3.C
N$13
  Top 0.152: R11.1 33.4,87.17 Q1.G2
N$16
  Top 0.152: L513SRD.A R12.2
N$17
  Top 0.152: R13.2 26.44,63.98 LTW-420D7(1).A
PWM_D3
  Top 0.152: U3.CN10_10 58.4,63.53 57.2,62.34 51.88,62.34 R8.1
PWM_D5
  Top 0.152: U3.CN10_6 58.4,68.61 57.2,67.42 50.28,67.42 48.74,68.96 R7.1
PWM_D6
  Top 0.152: R5.1 40.08,70.46 49.98,70.46 51.87,72.35 57.93,72.35 U3.CN10_4
RX_D0
  Top 0.152: Q1.S1 35.12,76.49 R3.1
  Bottom 0.152: U3.CN10_16 60.21,55.91 61,56.7 61,58.7 60,59.7 39,59.7 34.88,63.82 R3.1
TX_D1
  Bottom 0.152: R11.2 23.8,71.9 38.8,56.9 55.58,56.9 55.88,57.2 57.88,57.2 U3.CN10_14

### Text on the board
tPlace: Manual RC Board V1 | Robojackets / Roboracing Electrical